# Altium project Front.PrjPCB (part 2 of 2)

## Sheet Charging.SchDoc
size A; SheetNumber: 6
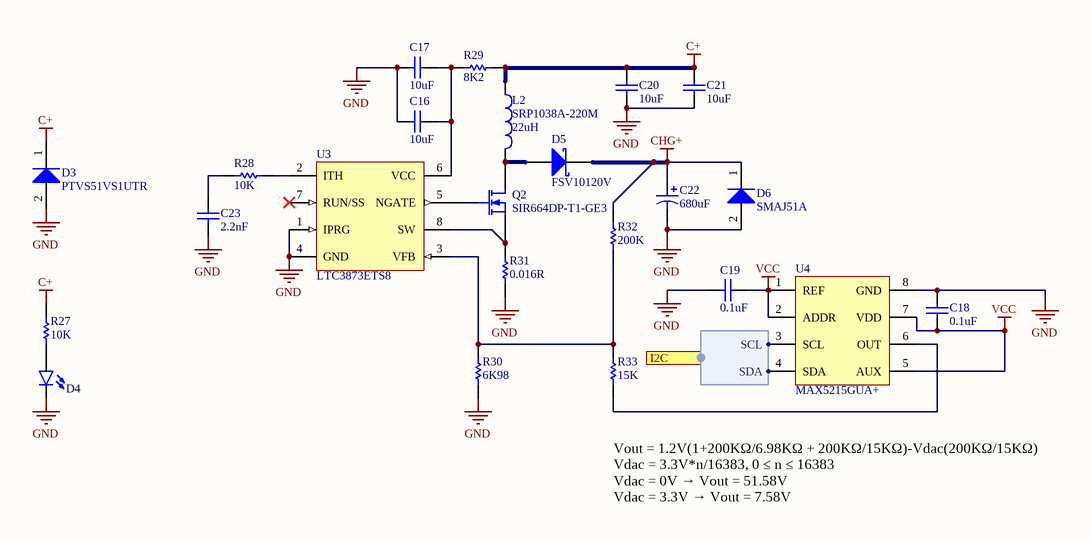
[diagram p9: Charging.SchDoc]

### Parts
C16  value 10uF  [C0603[1608X92]]  (hidden comment: 10uF 16V 0603)
C17  value 10uF  [C0603[1608X92]]  (hidden comment: 10uF 16V 0603)
C18  value 0.1uF  [C0603[1608X92]]  (hidden comment: 0.1uF 6.3V 0603)
C19  value 0.1uF  [C0603[1608X92]]  (hidden comment: 0.1uF 6.3V 0603)
C20  value 10uF  [C1206[3216X160]]  (hidden comment: 10uF 50V 1206)
C21  value 10uF  [C1206[3216X160]]  (hidden comment: 10uF 50V 1206)
C22  value 680uF  [CAP-ELECTROLYTIC[10.0x12.6]]  (hidden comment: 180uF 50V)
C23  value 2.2nF  [C0603[1608X92]]  (hidden comment: 2.2nF 50V 0603)
D3  PTVS51VS1UTR  [SOD-123W]
D4  LED_0603_GREEN_5mA  [LED0603]  (value not drawn)
D5  FSV10120V  [TO-277]
D6  SMAJ51A  [DO-214AC]
L2  SRP1038A-220M  value 22uH  [SRP1038A]
Q2  SIR664DP-T1-GE3  [PowerPak-8]
R27  value 10K  [R0603[1608]]  (hidden comment: 10K 1% 0603)
R28  value 10K  [R0603[1608]]  (hidden comment: 10K 1% 0603)
R29  value 8K2  [R0603[1608]]  (hidden comment: 8K2 1% 0603)
R30  value 6K98  [R0603[1608]]  (hidden comment: 6K98 1% 0603)
R31  value 0.016R  [R1206[3216]]  (hidden comment: 0.016R 1% 1206)
R32  value 200K  [R0603[1608]]  (hidden comment: 200K 1% 0603)
R33  value 15K  [R0603[1608]]  (hidden comment: 15K 1% 0603)
U3  LTC3873ETS8  [SOT-23-8]
U4  MAX5215GUA+  [MSOP-8]

### Ports
I2C (harness I2C)

### Harnesses
I2C: SCL, SDA

### Nets
C+: C20.2 C21.2 D3.1(K) L2.1 R27.2 R29.2
CHG+: C22.1 D5.1(K) D6.1(K) R32.2
GND: C16.1 C17.1 C18.1 C19.2 C20.1 C21.1 C22.2 C23.1 D3.2(A) D4.C D6.2(A) R30.1 R31.1 U3.1(IPRG) U3.4(GND) U4.8(GND)
VCC: C18.2 C19.1 U4.1(REF) U4.2(ADDR) U4.5(AUX) U4.7(VDD)
I2C3.SCL: U4.3(SCL) ; port I2C.SCL
I2C3.SDA: U4.4(SDA) ; port I2C.SDA
NetC16_2: C16.2 C17.2 R29.1 U3.6(VCC)
NetC23_2: C23.2 R28.1
NetD4_A: D4.A R27.1
NetD5_2: D5.2(A) L2.2 Q2.3(D)
NetQ2_1: Q2.1(S) R31.2 U3.8(SW)
NetQ2_2: Q2.2(G) U3.5(NGATE)
NetR28_2: R28.2 U3.2(ITH)
NetR30_2: R30.2 R32.1 R33.2 U3.3(VFB)
NetR33_1: R33.1 U4.6(OUT)

Not connected (* = marked no-connect by the designer): U3 7(RUN/SS)*

### Notes on the sheet
- Vout = 1.2V(1+200KΩ/6.98KΩ + 200KΩ/15KΩ)-Vdac(200KΩ/15KΩ)
  Vdac = 3.3V*n/16383, 0 ≤ n ≤ 16383
  Vdac = 0V → Vout = 51.58V
  Vdac = 3.3V → Vout = 7.58V

### Library data of the parts
C16 C17 = CAP_10uF_16V_0603_10%: 10uF 16V 10% 0603 (1608 Metric); PartNumber: GRM188R61C106KAALD; Manufacturer: Murata; TemperatureCoefficient: X5R; Mounting Technology: Surface Mount; PackageReference: 0603; PackageDescription: 0603 (1608 Metric); Voltage: 16V; Tolerance: 10%
C18 C19 = CAP_0.1uF_6.3V_0603_10%: 0.1uF 6.3V 10% 0603 (1608 Metric); PartNumber: GRM188R70J104KA01D; Manufacturer: Murata; Mounting Technology: Surface Mount; PackageReference: 0603; PackageDescription: 0603 (1608 Metric); Voltage: 6.3V; Tolerance: 10%
C20 C21 = CAP_10uF_50V_1206_20%: 10uF 50V 20% 1206 (3216 Metric); PartNumber: UMK316BBJ106ML-T; Manufacturer: Taiyo Yuden; Tolerance: 20%; Mounting Technology: Surface Mount; PackageReference: 1206; PackageDescription: 1206 (3216 Metric); Voltage: 50V
C22 = CAP_180uF_50V_20%: 180uF 50V 20%; PartNumber: PCR1H181MCL1GS; Manufacturer: Nichicon; PackageReference: 1H; PackageDescription: 5mm; Mounting Technology: Surface Mount; Voltage: 50V; Tolerance: 20%
C23 = CAP_2.2nF_50V_0603_5%: 2.2nF 50V 5% 0603 (1608 Metric); PartNumber: GRM1885C1H222JA01D; Manufacturer: Murata; TemperatureCoefficient: C0G; Mounting Technology: Surface Mount; PackageReference: 0603; PackageDescription: 0603 (1608 Metric); Voltage: 50V; Tolerance: 5%
D3 = PTVS51VS1UTR,115: Manufacturer: NXP; Mounting Technology: Surface Mount; PartNumber: PTVS51VS1UTR,115; PackageReference: SOD-123W; PackageDescription: SOD123W, 2-Leads
D4 = LED_0603_GREEN_5mA: PartNumber: LTST-C193TGKT-5A; Manufacturer: Lite-On Inc.; PackageReference: 0603; PackageDescription: 0603 (1608 Metric); Mounting Technology: Surface Mount
D5 = FSV10120V: Schottky Diodes & Rectifiers 10 Amp 120V Schottky Rectifier; Manufacturer: Fairchild Semiconductor; PackageReference: TO-277-3; PartNumber: FSV10120V; Mounting Technology: Surface Mount
D6 = SMAJ51A-E3/61: Manufacturer: Vishay; PartNumber: SMAJ51A-E3/61; PackageReference: DO-214AC; PackageDescription: DO-214AC, 2 Leads; Mounting Technology: Surface Mount
L2 = SRP1038A-220M: 22uH 20% 7A 1038; Manufacturer: Bourns; PackageReference: SRP1038A; PartNumber: SRP1038A-220M; Mounting Technology: Surface Mount; Current: 7A
Q2 = SIR664DP-T1-GE3: N-Channel MOSFET; Manufacturer: Vishay; PartNumber: SIR664DP-T1-GE3; Mounting Technology: Surface Mount; PackageReference: PowerPAK-8
R27 R28 = RES_10K_0603_1%: 10K 0.25W 1% 0603 (1005 Metric); Manufacturer: Vishay; PartNumber: RCS060310K0FKEA; Power: 0.25W; Tolerance: 1%; Mounting Technology: Surface Mount; PackageReference: 0603; PackageDescription: 0603 (1608 Metric); ComponentLink1Description: Datasheet; ComponentLink1URL: http://www.vishay.com/docs/20065/rcse3.pdf
R29 = RES_8K2_0603_1%: 8K2 0.25W 1% 0603 (1005 Metric); Manufacturer: Vishay; PartNumber: CRCW06038K20FKEAHP; Tolerance: 1%; Power: 0.25W; Mounting Technology: Surface Mount; PackageReference: 0603; PackageDescription: 0603 (1608 Metric); ComponentLink1Description: Datasheet; ComponentLink1URL: http://www.vishay.com/docs/20043/crcwhpe3.pdf
R30 = RES_6K98_0603_1%: 6K98 0.25W 1% 0603 (1005 Metric); Manufacturer: Vishay / Dale; PartNumber: CRCW06036K98FKEAHP; Tolerance: 1%; Power: 0.25W; Mounting Technology: Surface Mount; PackageReference: 0603; PackageDescription: 0603 (1608 Metric); ComponentLink1Description: Datasheet; ComponentLink1URL: http://www.vishay.com/docs/20043/crcwhpe3.pdf
R31 = RES_0.016R_1206_1%: 0.016R 1W 1% 1206 (3216 Metric); Manufacturer: Panasonic; PartNumber: ERJ-8CWFR016V; Power: 1W; Tolerance: 1%; Mounting Technology: Surface Mount; PackageReference: 1206; PackageDescription: 1206 (3216 Metric); ComponentLink1Description: Datasheet; ComponentLink1URL: https://industrial.panasonic.com/cdbs/www-data/pdf/RDA0000/AOA0000C239.pdf
R32 = RES_200K_0603_1%: 200K 0.25W 1% 0603 (1005 Metric); Manufacturer: Rohm Semiconductor; PartNumber: ESR03EZPJ204; Tolerance: 5%; Power: 0.25W; Mounting Technology: Surface Mount; PackageReference: 0603; PackageDescription: 0603 (1608 Metric); ComponentLink1Description: Datasheet; ComponentLink1URL: http://www.vishay.com/docs/20043/crcwhpe3.pdf
R33 = RES_15K_0603_1%: 15K 0.25W 1% 0603 (1005 Metric); Manufacturer: Vishay / Dale; PartNumber: CRCW060315K0FKEAHP; Tolerance: 1%; Power: 0.25W; Mounting Technology: Surface Mount; PackageReference: 0603; PackageDescription: 0603 (1608 Metric); ComponentLink1Description: Datasheet; ComponentLink1URL: http://www.vishay.com/docs/20043/crcwhpe3.pdf
U3 = LTC3873ETS8: PartNumber: LTC3873ETS8#PBF; Manufacturer: Linear Technology; PackageReference: TSOT-23-8; Mounting Technology: Surface Mount
U4 = MAX5215GUA+: 14 Bit Digital to Analog Converter; Manufacturer: Maxim Integrated; PartNumber: MAX5215GUA+; Mounting Technology: Surface Mount; PackageReference: MSOP-8

## Sheet Bluetooth.SchDoc
size A4
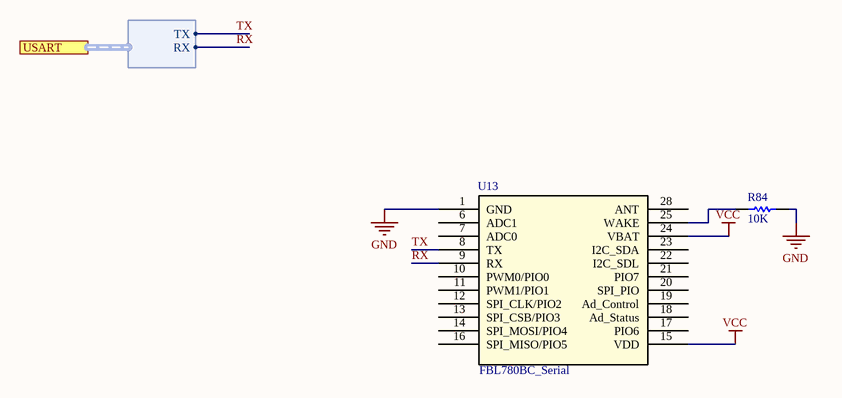
[diagram p10: Bluetooth.SchDoc]

### Parts
R84  value 10K  [R0603[1608]]  (hidden comment: 10K 1% 0603)
U13  FBL780BC_Serial  [FBL780BC_Serial]

### Ports
USART (harness USART2)

### Harnesses
USART2: TX, RX

### Nets
GND: R84.2 U13.1(GND)
VCC: U13.15(VDD) U13.24(VBAT)
RX: U13.9(RX) ; port USART.RX
TX: U13.8(TX) ; port USART.TX
NetR84_1: R84.1 U13.25(WAKE)

Not connected (* = marked no-connect by the designer): U13 6(ADC1) 7(ADC0) 10(PWM0/PIO0) 11(PWM1/PIO1) 12(SPI_CLK/PIO2) 13(SPI_CSB/PIO3) 14(SPI_MOSI/PIO4) 16(SPI_MISO/PIO5) 17(PIO6) 18(Ad_Status) 19(Ad_Control) 20(SPI_PIO) 21(PIO7) 22(I2C_SDL) 23(I2C_SDA) 28(ANT)

### Library data of the parts
R84 = RES_10K_0603_1%: as R27 on sheet Charging; Tolerance: 1%; Power: 0.25W; Mounting Technology: Surface Mount; PackageReference: 0603; PackageDescription: 0603 (1608 Metric); ComponentLink1Description: Datasheet; ComponentLink1URL: http://www.vishay.com/docs/20065/rcse3.pdf
U13 = FBL780BC_Serial: Manufacturer: Firmtech; PartNumber: FBL780BC_Serial

## Sheet CurrentSense.SchDoc
size A; SheetNumber: 8
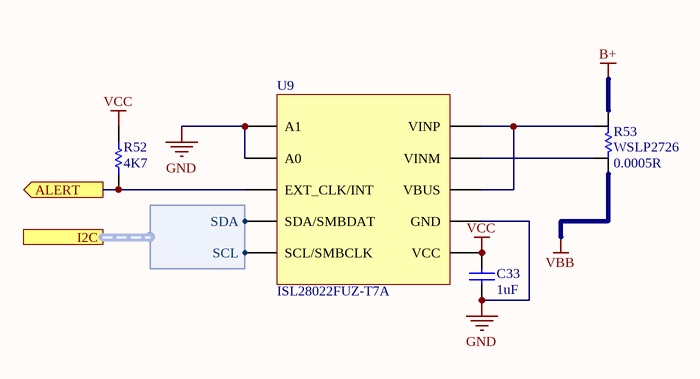
[diagram p11: CurrentSense.SchDoc]

### Parts
C33  value 1uF  [C0603[1608X92]]  (hidden comment: 1uF 6.3V 0603)
R52  value 4K7  [R0603[1608]]  (hidden comment: 4K7 1% 0603)
R53  WSLP2726  value 0.0005R  [WSL2726]
U9  ISL28022FUZ-T7A  [MSOP-10]

### Ports
ALERT (out), I2C (harness I2C)

### Harnesses
I2C: SCL, SDA

### Nets
B+: R53.2
GND: C33.1 U9.1(A1) U9.2(A0) U9.7(GND)
VBB: R53.1
VCC: C33.2 R52.2 U9.6(VCC)
I2C3.SCL: U9.5(SCL/SMBCLK) ; port I2C.SCL
I2C3.SDA: U9.4(SDA/SMBDAT) ; port I2C.SDA
NetR52_1: R52.1 U9.3(EXT_CLK/INT) ; port ALERT
NetR53_3: R53.3 U9.9(VINM)
NetR53_4: R53.4 U9.8(VBUS) U9.10(VINP)

### Library data of the parts
C33 = CAP_1uF_6.3V_0603_10%: 1uF 6.3V 10% 0603 (1608 Metric); PartNumber: GRM188R60J105KA01D; Manufacturer: Murata; TemperatureCoefficient: X5R; Mounting Technology: Surface Mount; PackageReference: 0603; PackageDescription: 0603 (1608 Metric); Voltage: 6.3V; Tolerance: 10%
R52 = RES_4K7_0603_1%: 4K7 0.25W 1% 0603 (1005 Metric); Manufacturer: Vishay / Dale; PartNumber: CRCW06034K70FKEAHP; Tolerance: 1%; Power: 0.25W; Mounting Technology: Surface Mount; PackageReference: 0603; PackageDescription: 0603 (1608 Metric); ComponentLink1Description: Datasheet; ComponentLink1URL: http://www.vishay.com/docs/20043/crcwhpe3.pdf
R53 = WSLP2726: Current Sense Resistor, 0.0005R; PartNumber: WSLP2726L5000FEA; Manufacturer: Vishay / Dale; Power: 7W; Tolerance: 1%; PackageReference: 2726; Mounting Technology: Surface Mount
U9 = ISL28022FUZ-T7A: Manufacturer: Intersil; PartNumber: ISL28022FUZ-T7A; Mounting Technology: Surface Mount; PackageReference: MSOP-10

## Sheet LTC6803.SchDoc
size A; SheetNumber: 4
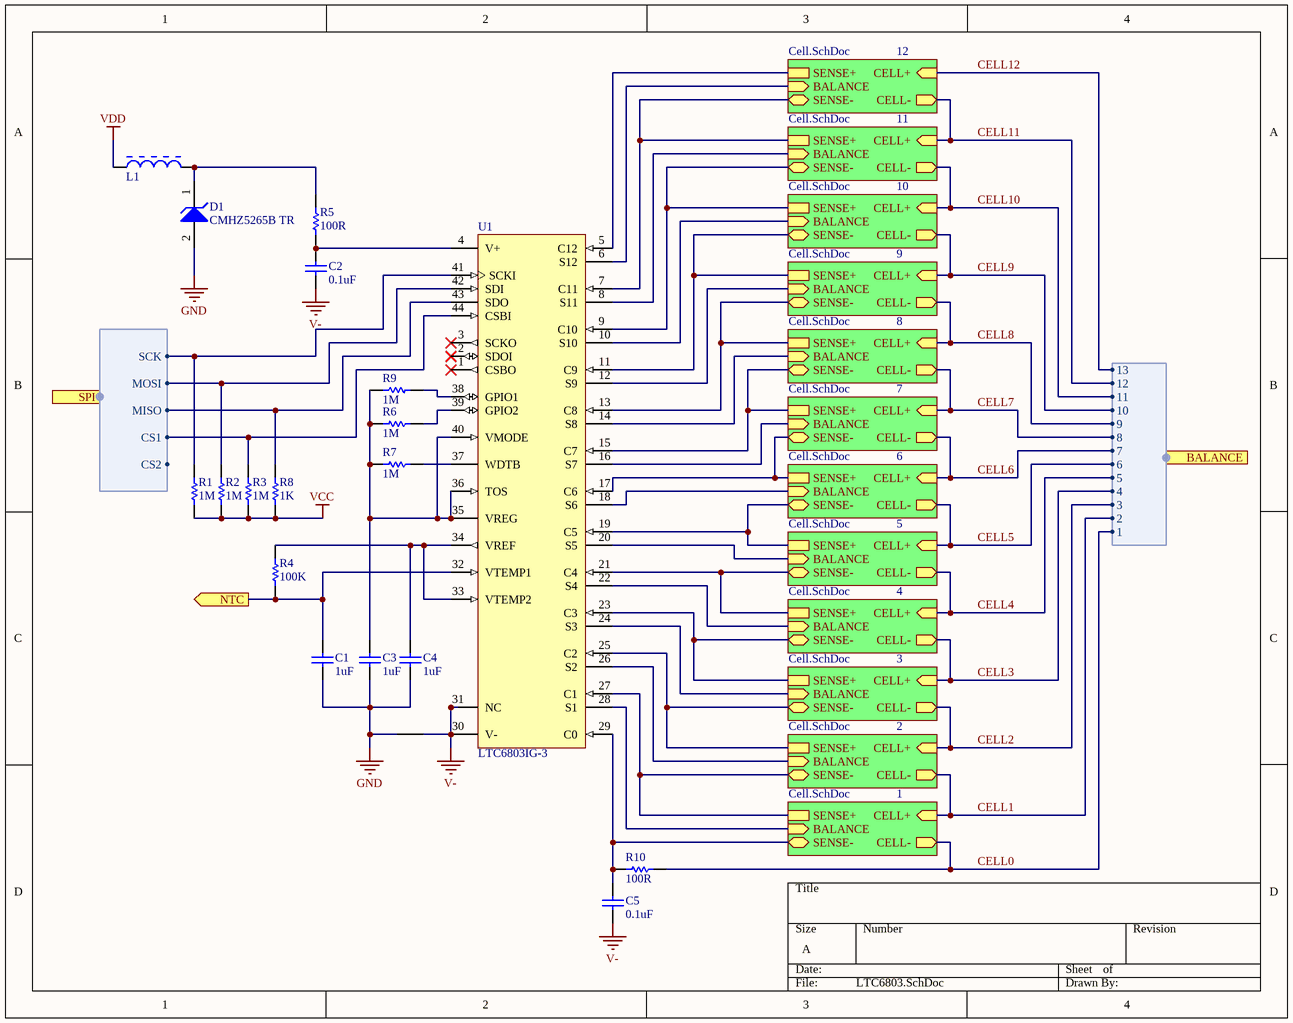
[diagram p12: LTC6803.SchDoc]

### Parts
*  NetTie  [NetTie]  (value not drawn)  (net tie, no BOM)
C1  value 1uF  [C0603[1608X92]]  (hidden comment: 1uF 6.3V 0603)
C2  value 0.1uF  [C0603[1608X92]]  (hidden comment: 0.1uF 100V 0603)
C3  value 1uF  [C0603[1608X92]]  (hidden comment: 1uF 6.3V 0603)
C4  value 1uF  [C0603[1608X92]]  (hidden comment: 1uF 6.3V 0603)
C5  value 0.1uF  [C0603[1608X92]]  (hidden comment: 0.1uF 6.3V 0603)
D1  CMHZ5265B TR  [SOD-123]
L1  MURA-FB-2  [MURA-BLM31-B60-CHIP-2_V3]  (value not drawn)
R1  value 1M  [R0603[1608]]  (hidden comment: 1M 1% 0603)
R2  value 1M  [R0603[1608]]  (hidden comment: 1M 1% 0603)
R3  value 1M  [R0603[1608]]  (hidden comment: 1M 1% 0603)
R4  value 100K  [R0603[1608]]  (hidden comment: 100K 1% 0603)
R5  value 100R  [R0603[1608]]  (hidden comment: 100R 1% 0603)
R6  value 1M  [R0603[1608]]  (hidden comment: 1M 1% 0603)
R7  value 1M  [R0603[1608]]  (hidden comment: 1M 1% 0603)
R8  value 1K  [R0603[1608]]  (hidden comment: 1K 1% 0603)
R9  value 1M  [R0603[1608]]  (hidden comment: 1M 1% 0603)
R10  value 100R  [R0603[1608]]  (hidden comment: 100R 1% 0603)
U1  LTC6803IG-3  [TSSOP-44]

### Sub-sheets
1 = Cell.SchDoc: SENSE+, SENSE- (bidir), BALANCE (in), CELL+ (in), CELL- (out)
2 = Cell.SchDoc: SENSE+, SENSE- (bidir), BALANCE (in), CELL+ (in), CELL- (out)
3 = Cell.SchDoc: SENSE+, SENSE- (bidir), BALANCE (in), CELL+ (in), CELL- (out)
4 = Cell.SchDoc: SENSE+, SENSE- (bidir), BALANCE (in), CELL+ (in), CELL- (out)
5 = Cell.SchDoc: SENSE+, SENSE- (bidir), BALANCE (in), CELL+ (in), CELL- (out)
6 = Cell.SchDoc: SENSE+, SENSE- (bidir), BALANCE (in), CELL+ (in), CELL- (out)
7 = Cell.SchDoc: SENSE+, SENSE- (bidir), BALANCE (in), CELL+ (in), CELL- (out)
8 = Cell.SchDoc: SENSE+, SENSE- (bidir), BALANCE (in), CELL+ (in), CELL- (out)
9 = Cell.SchDoc: SENSE+, SENSE- (bidir), BALANCE (in), CELL+ (in), CELL- (out)
10 = Cell.SchDoc: SENSE+, SENSE- (bidir), BALANCE (in), CELL+ (in), CELL- (out)
11 = Cell.SchDoc: SENSE+, SENSE- (bidir), BALANCE (in), CELL+ (in), CELL- (out)
12 = Cell.SchDoc: SENSE+, SENSE- (bidir), BALANCE (in), CELL+ (in), CELL- (out)

### Ports
BALANCE (harness Balance), NTC (out), SPI (harness SPI)

### Harnesses
SPI: SCK, MOSI, MISO, CS1, CS2
Balance: 13, 12, 11, 10, 9, 8, 6, 7, 5, 3, 4, 2, 1

### Nets
GND: *.1 C1.1 C3.1 C4.1 D1.2(A)
V-: *.2 C2.1 C5.1 U1.30(V-) U1.31(NC)
VCC: R1.1 R2.1 R3.1 R8.1
VDD: L1.1
CELL0: R10.1 ; sheet 1/CELL-, port BALANCE.1
CELL1: sheet 2/CELL-, sheet 1/CELL+, port BALANCE.2
CELL2: sheet 3/CELL-, sheet 2/CELL+, port BALANCE.3
CELL3: sheet 4/CELL-, sheet 3/CELL+, port BALANCE.4
CELL4: sheet 5/CELL-, sheet 4/CELL+, port BALANCE.5
CELL5: sheet 6/CELL-, sheet 5/CELL+, port BALANCE.6
CELL6: sheet 7/CELL-, sheet 6/CELL+, port BALANCE.7
CELL7: sheet 8/CELL-, sheet 7/CELL+, port BALANCE.8
CELL8: sheet 9/CELL-, sheet 8/CELL+, port BALANCE.9
CELL9: sheet 10/CELL-, sheet 9/CELL+, port BALANCE.10
CELL10: sheet 11/CELL-, sheet 10/CELL+, port BALANCE.11
CELL11: sheet 12/CELL-, sheet 11/CELL+, port BALANCE.12
CELL12: sheet 12/CELL+, port BALANCE.13
SPI2.CS1: R3.2 U1.44(CSBI) ; port SPI.CS1
SPI2.MISO: R8.2 U1.43(SDO) ; port SPI.MISO
SPI2.MOSI: R2.2 U1.42(SDI) ; port SPI.MOSI
SPI2.SCK: R1.2 U1.41(SCKI) ; port SPI.SCK
NetC1_2: C1.2 R4.1 U1.32(VTEMP1) ; port NTC
NetC2_2: C2.2 R5.1 U1.4(V+)
NetC3_2: C3.2 R6.2 R7.2 R9.2 U1.35(VREG) U1.36(TOS) U1.40(VMODE)
NetC4_2: C4.2 R4.2 U1.33(VTEMP2) U1.34(VREF)
NetC5_2: C5.2 R10.2 U1.29(C0) ; sheet 1/SENSE-
NetC23_1_2: U1.27(C1) ; sheet 2/SENSE-, sheet 1/SENSE+
NetC23_2_2: U1.25(C2) ; sheet 3/SENSE-, sheet 2/SENSE+
NetC23_3_2: U1.23(C3) ; sheet 4/SENSE-, sheet 3/SENSE+
NetC23_4_2: U1.21(C4) ; sheet 5/SENSE-, sheet 4/SENSE+
NetC23_5_2: U1.19(C5) ; sheet 6/SENSE-, sheet 5/SENSE+
NetC23_6_2: U1.17(C6) ; sheet 7/SENSE-, sheet 6/SENSE+
NetC23_7_2: U1.15(C7) ; sheet 8/SENSE-, sheet 7/SENSE+
NetC23_8_2: U1.13(C8) ; sheet 9/SENSE-, sheet 8/SENSE+
NetC23_9_2: U1.11(C9) ; sheet 10/SENSE-, sheet 9/SENSE+
NetC23_10_2: U1.9(C10) ; sheet 11/SENSE-, sheet 10/SENSE+
NetC23_11_2: U1.7(C11) ; sheet 12/SENSE-, sheet 11/SENSE+
NetC23_12_2: U1.5(C12) ; sheet 12/SENSE+
NetD1_1: D1.1(K) L1.2 R5.2
NetQ3_1_1: U1.28(S1) ; sheet 1/BALANCE
NetQ3_2_1: U1.26(S2) ; sheet 2/BALANCE
NetQ3_3_1: U1.24(S3) ; sheet 3/BALANCE
NetQ3_4_1: U1.22(S4) ; sheet 4/BALANCE
NetQ3_5_1: U1.20(S5) ; sheet 5/BALANCE
NetQ3_6_1: U1.18(S6) ; sheet 6/BALANCE
NetQ3_7_1: U1.16(S7) ; sheet 7/BALANCE
NetQ3_8_1: U1.14(S8) ; sheet 8/BALANCE
NetQ3_9_1: U1.12(S9) ; sheet 9/BALANCE
NetQ3_10_1: U1.10(S10) ; sheet 10/BALANCE
NetQ3_11_1: U1.8(S11) ; sheet 11/BALANCE
NetQ3_12_1: U1.6(S12) ; sheet 12/BALANCE
NetR6_1: R6.1 U1.39(GPIO2)
NetR7_1: R7.1 U1.37(WDTB)
NetR9_1: R9.1 U1.38(GPIO1)

Not connected (* = marked no-connect by the designer): U1 1(CSBO)* 2(SDOI)* 3(SCKO)*

### Library data of the parts
C1 C3 C4 = CAP_1uF_6.3V_0603_10%: as C33 on sheet CurrentSense; Mounting Technology: Surface Mount; PackageReference: 0603; PackageDescription: 0603 (1608 Metric); Voltage: 6.3V; Tolerance: 10%
C2 = CAP_0.1uF_100V_0603_10%: 0.1uF 100V 10% 0603 (1608 Metric); PartNumber: GRM188R72A104KA35D; Manufacturer: Murata; TemperatureCoefficient: X7R; Mounting Technology: Surface Mount; PackageReference: 0603; PackageDescription: 0603 (1608 Metric); Voltage: 100V; Tolerance: 10%
C5 = CAP_0.1uF_6.3V_0603_10%: as C18 on sheet Charging; Mounting Technology: Surface Mount; PackageReference: 0603; PackageDescription: 0603 (1608 Metric); Voltage: 6.3V; Tolerance: 10%
D1 = CMHZ5265B: Zener Diodes 500mW Zener Diode 185mA 58.9V to 2V; Manufacturer: Central Semiconductor; PartNumber: CMHZ5265B; Mounting Technology: Surface Mount; PackageReference: SOD-123; PackageDescription: SOD, 2-Leads, Body 2.69x1.6mm
L1 = MURA-FB-2: EMI Filter Beads, Chips & Arrays 1206 33 OHM; PartNumber: BLM31PG330SN1L; Manufacturer: Murata; Mounting Technology: Surface Mount; PackageReference: 1206; PackageDescription: 1206 (3216 Metric)
R1-R3 R6 R7 R9 = RES_1M_0603_1%: 1M 0.25W 1% 0603 (1005 Metric); Manufacturer: Vishay / Dale; PartNumber: CRCW06031M00JNEAHP; Tolerance: 5%; Power: 0.25W; Mounting Technology: Surface Mount; PackageReference: 0603; PackageDescription: 0603 (1608 Metric); ComponentLink1Description: Datasheet; ComponentLink1URL: http://www.vishay.com/docs/20043/crcwhpe3.pdf
R4 = RES_100K_0603_1%: 100K 0.25W 1% 0603 (1005 Metric); Manufacturer: Vishay / Dale; PartNumber: CRCW0603100KFKEAHP; Tolerance: 1%; Power: 0.25W; Mounting Technology: Surface Mount; PackageReference: 0603; PackageDescription: 0603 (1608 Metric); ComponentLink1Description: Datasheet; ComponentLink1URL: http://www.vishay.com/docs/20043/crcwhpe3.pdf
R5 R10 = RES_100R_0603_1%: 100R 0.25W 1% 0603 (1005 Metric); Manufacturer: Vishay / Dale; PartNumber: CRCW0603100RFKEAHP; Tolerance: 1%; Power: 0.25W; Mounting Technology: Surface Mount; PackageReference: 0603; PackageDescription: 0603 (1608 Metric); ComponentLink1Description: Datasheet; ComponentLink1URL: http://www.vishay.com/docs/20043/crcwhpe3.pdf
R8 = RES_1K_0603_1%: 1K 0.25W 1% 0603 (1005 Metric); Manufacturer: Vishay / Dale; PartNumber: CRCW06031K00FKEAHP; Tolerance: 1%; Power: 0.25W; Mounting Technology: Surface Mount; PackageReference: 0603; PackageDescription: 0603 (1608 Metric); ComponentLink1Description: Datasheet; ComponentLink1URL: http://www.vishay.com/docs/20043/crcwhpe3.pdf
U1 = LTC6803IG-3: PartNumber: LTC6803IG-3#PBF; Manufacturer: Linear Technology; PackageReference: TSSOP-44; Mounting Technology: Surface Mount; PackageDescription: SOP, 44-Leads, Body 13.1x5.6mm, Pitch 0.5mm

## Sheet Cell.SchDoc
size A; SheetNumber: 5
Used 12 times, as channels U_LTC6803/12, U_LTC6803/11, U_LTC6803/10, U_LTC6803/9, U_LTC6803/8, U_LTC6803/7, U_LTC6803/6, U_LTC6803/5, U_LTC6803/4, U_LTC6803/3, U_LTC6803/2, U_LTC6803/1. Parts and nets are listed once, with the designators drawn on the sheet.
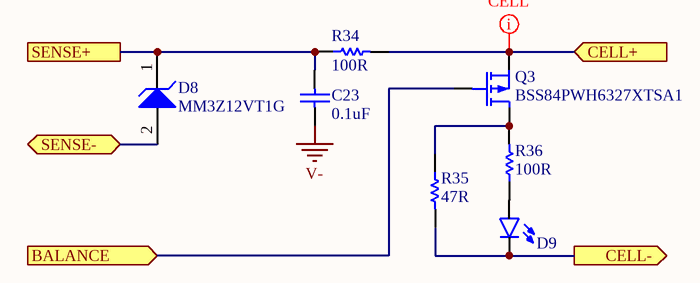
[diagram p13: Cell.SchDoc]

### Parts
C23  value 0.1uF  [C0603[1608X92]]  (hidden comment: 0.1uF 100V 0603)
D8  MM3Z12VT1G  [SOD-323]
D9  LED_0603_BLUE_5mA  [LED0603]  (value not drawn)
Q3  BSS84PWH6327XTSA1  [SOT323-3]
R34  value 100R  [R0603[1608]]  (hidden comment: 100R 1% 0603)
R35  value 47R  [R0805[2012]]  (hidden comment: 47R 5% 0805)
R36  value 100R  [R0603[1608]]  (hidden comment: 100R 1% 0603)

### Ports
BALANCE (in), CELL+ (in), CELL- (out), SENSE+, SENSE- (bidir)

### Nets
V-: C23.1
BALANCE: Q3.1(G) ; port BALANCE
CELL+: Q3.2(S) R34.1 ; port CELL+
CELL-: D9.C R35.1 ; port CELL-
SENSE+: C23.2 D8.1(K) R34.2 ; port SENSE+
SENSE-: D8.2(A) ; port SENSE-
NetD9_A: D9.A R36.2
NetQ3_3: Q3.3(D) R35.2 R36.1

### Channels
U_LTC6803/12: designators end in _12; ports BALANCE=NetQ3_12_1 CELL+=CELL12 CELL-=CELL11 SENSE+=NetC23_12_2 SENSE-=NetC23_11_2
U_LTC6803/11: designators end in _11; ports BALANCE=NetQ3_11_1 CELL+=CELL11 CELL-=CELL10 SENSE+=NetC23_11_2 SENSE-=NetC23_10_2
U_LTC6803/10: designators end in _10; ports BALANCE=NetQ3_10_1 CELL+=CELL10 CELL-=CELL9 SENSE+=NetC23_10_2 SENSE-=NetC23_9_2
U_LTC6803/9: designators end in _9; ports BALANCE=NetQ3_9_1 CELL+=CELL9 CELL-=CELL8 SENSE+=NetC23_9_2 SENSE-=NetC23_8_2
U_LTC6803/8: designators end in _8; ports BALANCE=NetQ3_8_1 CELL+=CELL8 CELL-=CELL7 SENSE+=NetC23_8_2 SENSE-=NetC23_7_2
U_LTC6803/7: designators end in _7; ports BALANCE=NetQ3_7_1 CELL+=CELL7 CELL-=CELL6 SENSE+=NetC23_7_2 SENSE-=NetC23_6_2
U_LTC6803/6: designators end in _6; ports BALANCE=NetQ3_6_1 CELL+=CELL6 CELL-=CELL5 SENSE+=NetC23_6_2 SENSE-=NetC23_5_2
U_LTC6803/5: designators end in _5; ports BALANCE=NetQ3_5_1 CELL+=CELL5 CELL-=CELL4 SENSE+=NetC23_5_2 SENSE-=NetC23_4_2
U_LTC6803/4: designators end in _4; ports BALANCE=NetQ3_4_1 CELL+=CELL4 CELL-=CELL3 SENSE+=NetC23_4_2 SENSE-=NetC23_3_2
U_LTC6803/3: designators end in _3; ports BALANCE=NetQ3_3_1 CELL+=CELL3 CELL-=CELL2 SENSE+=NetC23_3_2 SENSE-=NetC23_2_2
U_LTC6803/2: designators end in _2; ports BALANCE=NetQ3_2_1 CELL+=CELL2 CELL-=CELL1 SENSE+=NetC23_2_2 SENSE-=NetC23_1_2
U_LTC6803/1: designators end in _1; ports BALANCE=NetQ3_1_1 CELL+=CELL1 CELL-=CELL0 SENSE+=NetC23_1_2 SENSE-=NetC5_2

### Layout directives
net class CELL: CELL12

### Library data of the parts
C23 = CAP_0.1uF_100V_0603_10%: as C2 on sheet LTC6803; Mounting Technology: Surface Mount; PackageReference: 0603; PackageDescription: 0603 (1608 Metric); Voltage: 100V; Tolerance: 10%
D8 = MM3Z12VT1G: Zener Voltage Regulator, 300 mW, 2-Pin SOD-323, Tape and Reel; Manufacturer: ON Semiconductor; Mounting Technology: Surface Mount; PackageDescription: SOD, 2-Leads; PartNumber: MM3Z12VT1G; PackageReference: SOD-323
D9 = LED_0603_BLUE_5mA: PartNumber: LTST-C193TBKT-5A; Manufacturer: Lite-On Inc.; PackageReference: 0603; PackageDescription: 0603 (1608 Metric); Mounting Technology: Surface Mount
Q3 = BSS84PW H6327: P-Channel MOSFET; Manufacturer: Infineon; Mounting Technology: Surface Mount; PartNumber: BSS84PWH6327XTSA1; PackageReference: SOT323-3
R34 R36 = RES_100R_0603_1%: as R5 on sheet LTC6803; Tolerance: 1%; Power: 0.25W; Mounting Technology: Surface Mount; PackageReference: 0603; PackageDescription: 0603 (1608 Metric); ComponentLink1Description: Datasheet; ComponentLink1URL: http://www.vishay.com/docs/20043/crcwhpe3.pdf
R35 = RES_47R_0805_5%: 47R 0.5W 5% 0805 (2012 Metric); Manufacturer: Panasonic; PartNumber: ERJ-P06J470V; Tolerance: 5%; Power: 0.5W; Mounting Technology: Surface Mount; PackageReference: 0805; PackageDescription: 0805 (2012 Metric); ComponentLink1Description: Datasheet; ComponentLink1URL: https://industrial.panasonic.com/cdbs/www-data/pdf/RDA0000/AOA0000C243.pdf

## Sheet Flash.SchDoc
size A; SheetNumber: 12
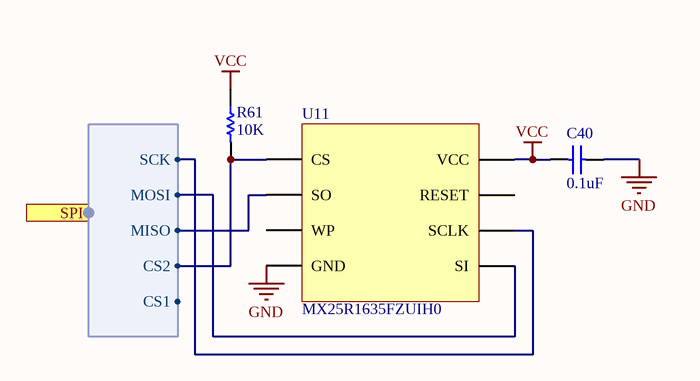
[diagram p14: Flash.SchDoc]

### Parts
C40  value 0.1uF  [C0603[1608X92]]  (hidden comment: 0.1uF 6.3V 0603)
R61  value 10K  [R0603[1608]]  (hidden comment: 10K 1% 0603)
U11  MX25R1635FZUIH0  [USON-8]

### Ports
SPI (harness SPI)

### Harnesses
SPI: SCK, MOSI, MISO, CS2, CS1

### Nets
GND: C40.2 U11.4(GND)
VCC: C40.1 R61.2 U11.8(VCC)
SPI2.CS2: R61.1 U11.1(CS) ; port SPI.CS2
SPI2.MISO: U11.2(SO) ; port SPI.MISO
SPI2.MOSI: U11.5(SI) ; port SPI.MOSI
SPI2.SCK: U11.6(SCLK) ; port SPI.SCK

Not connected (* = marked no-connect by the designer): U11 3(WP) 7(RESET)

### Library data of the parts
C40 = CAP_0.1uF_6.3V_0603_10%: as C18 on sheet Charging; Mounting Technology: Surface Mount; PackageReference: 0603; PackageDescription: 0603 (1608 Metric); Voltage: 6.3V; Tolerance: 10%
R61 = RES_10K_0603_1%: as R27 on sheet Charging; Tolerance: 1%; Power: 0.25W; Mounting Technology: Surface Mount; PackageReference: 0603; PackageDescription: 0603 (1608 Metric); ComponentLink1Description: Datasheet; ComponentLink1URL: http://www.vishay.com/docs/20065/rcse3.pdf
U11 = MX25R1635FZUIH0: pin to pad: 4>4+9; Manufacturer: Macronix; PartNumber: MX25R1635FZUIH0; Mounting Technology: Surface Mount; PackageReference: USON-8

## Nets that join several sheets
5V: 3V3 (10 pins), Connectors (5 pins), A_L (R66_A_L.2 R67_A_L.2), A_R (R66_A_R.2 R67_A_R.2)
AVDD: 3V3 (R81.2 R82.1), A_L (C68_A_L.2 U12_A_L.9), A_R (C68_A_R.2 U12_A_R.9)
B+: Switches (D16.1), CurrentSense (R53.2)
C1: Switches (D18.1 Q9.2 R41.2), Connectors (*1.2), RTCC (C34.2 U10.3)
C+: Switches (R38.2), Charging (6 pins)
CHG+: Switches (5 pins), Connectors (JP4.1), Charging (C22.1 D5.1 D6.1 R32.2)
GND: 3V3 (20 pins), MCU (30 pins), Switches (23 pins), Connectors (16 pins), CAN (C32.2 U8.2), RTCC (C34.1 C35.2 U10.4), Buzzer (Q13.2 R59.1), A_L (12 pins), Charging (16 pins), Bluetooth (R84.2 U13.1), A_R (12 pins), CurrentSense (C33.1 U9.1 U9.2 U9.7), LTC6803 (5 pins), Flash (C40.2 U11.4)
REF: 3V3 (R82.2 R83.1), A_L (C70_A_L.2 C71_A_L.2 U12_A_L.14), A_R (C70_A_R.2 C71_A_R.2 U12_A_R.14)
V-: LTC6803 (5 pins), U_LTC6803/12 (C23_12.1), U_LTC6803/11 (C23_11.1), U_LTC6803/10 (C23_10.1), U_LTC6803/9 (C23_9.1), U_LTC6803/8 (C23_8.1), U_LTC6803/7 (C23_7.1), U_LTC6803/6 (C23_6.1), U_LTC6803/5 (C23_5.1), U_LTC6803/4 (C23_4.1), U_LTC6803/3 (C23_3.1), U_LTC6803/2 (C23_2.1), U_LTC6803/1 (C23_1.1)
VBB: Switches (8 pins), CurrentSense (R53.1)
VCC: 3V3 (5 pins), MCU (36 pins), Switches (U7.5 U7.7), Connectors (6 pins), CAN (C32.1 U8.3), RTCC (C35.1 U10.8), Buzzer (LS1.1), A_L (C48_A_L.2 C49_A_L.2 U12_A_L.22), Charging (6 pins), Bluetooth (U13.15 U13.24), A_R (C48_A_R.2 C49_A_R.2 U12_A_R.22), CurrentSense (C33.2 R52.2 U9.6), LTC6803 (R1.1 R2.1 R3.1 R8.1), Flash (C40.1 R61.2 U11.8)
VDD: 3V3 (6 pins), Switches (Q7.2 R57.2), LTC6803 (L1.1)
VUSB: 3V3 (D11.2 D15.1), MCU (U2.69), Connectors (JP6.1)
AINP: Connectors (JP7.1), A_R (C55_A_R.2 R69_A_R.1 U12_A_R.12)
AINP: Connectors (JP7.4), A_L (C55_A_L.2 R69_A_L.1 U12_A_L.12)
CELL0: Connectors (JP1.1), LTC6803 (R10.1), U_LTC6803/1 (D9_1.C R35_1.1)
CELL1: Connectors (*1.1 JP1.2), U_LTC6803/2 (D9_2.C R35_2.1), U_LTC6803/1 (Q3_1.2 R34_1.1)
CELL2: Connectors (JP1.3), U_LTC6803/3 (D9_3.C R35_3.1), U_LTC6803/2 (Q3_2.2 R34_2.1)
CELL3: Connectors (JP1.4), U_LTC6803/4 (D9_4.C R35_4.1), U_LTC6803/3 (Q3_3.2 R34_3.1)
CELL4: Connectors (JP1.5), U_LTC6803/5 (D9_5.C R35_5.1), U_LTC6803/4 (Q3_4.2 R34_4.1)
CELL5: Connectors (JP1.6), U_LTC6803/6 (D9_6.C R35_6.1), U_LTC6803/5 (Q3_5.2 R34_5.1)
CELL6: Connectors (JP1.7), U_LTC6803/7 (D9_7.C R35_7.1), U_LTC6803/6 (Q3_6.2 R34_6.1)
CELL7: Connectors (JP1.8), U_LTC6803/8 (D9_8.C R35_8.1), U_LTC6803/7 (Q3_7.2 R34_7.1)
CELL8: Connectors (JP1.9), U_LTC6803/9 (D9_9.C R35_9.1), U_LTC6803/8 (Q3_8.2 R34_8.1)
CELL9: Connectors (JP1.10), U_LTC6803/10 (D9_10.C R35_10.1), U_LTC6803/9 (Q3_9.2 R34_9.1)
CELL10: Connectors (JP1.11), U_LTC6803/11 (D9_11.C R35_11.1), U_LTC6803/10 (Q3_10.2 R34_10.1)
CELL11: Connectors (JP1.12), U_LTC6803/12 (D9_12.C R35_12.1), U_LTC6803/11 (Q3_11.2 R34_11.1)
CELL12: Connectors (JP1.13), U_LTC6803/12 (Q3_12.2 R34_12.1)
I2C3.SCL: RTCC (U10.6), Charging (U4.3), CurrentSense (U9.5)
I2C3.SDA: RTCC (U10.5), Charging (U4.4), CurrentSense (U9.4)
NetC1_2: Connectors (JP2.1), LTC6803 (C1.2 R4.1 U1.32)
NetC5_2: LTC6803 (C5.2 R10.2 U1.29), U_LTC6803/1 (D8_1.2)
NetC23_1_2: LTC6803 (U1.27), U_LTC6803/2 (D8_2.2), U_LTC6803/1 (C23_1.2 D8_1.1 R34_1.2)
NetC23_2_2: LTC6803 (U1.25), U_LTC6803/3 (D8_3.2), U_LTC6803/2 (C23_2.2 D8_2.1 R34_2.2)
NetC23_3_2: LTC6803 (U1.23), U_LTC6803/4 (D8_4.2), U_LTC6803/3 (C23_3.2 D8_3.1 R34_3.2)
NetC23_4_2: LTC6803 (U1.21), U_LTC6803/5 (D8_5.2), U_LTC6803/4 (C23_4.2 D8_4.1 R34_4.2)
NetC23_5_2: LTC6803 (U1.19), U_LTC6803/6 (D8_6.2), U_LTC6803/5 (C23_5.2 D8_5.1 R34_5.2)
NetC23_6_2: LTC6803 (U1.17), U_LTC6803/7 (D8_7.2), U_LTC6803/6 (C23_6.2 D8_6.1 R34_6.2)
NetC23_7_2: LTC6803 (U1.15), U_LTC6803/8 (D8_8.2), U_LTC6803/7 (C23_7.2 D8_7.1 R34_7.2)
NetC23_8_2: LTC6803 (U1.13), U_LTC6803/9 (D8_9.2), U_LTC6803/8 (C23_8.2 D8_8.1 R34_8.2)
NetC23_9_2: LTC6803 (U1.11), U_LTC6803/10 (D8_10.2), U_LTC6803/9 (C23_9.2 D8_9.1 R34_9.2)
NetC23_10_2: LTC6803 (U1.9), U_LTC6803/11 (D8_11.2), U_LTC6803/10 (C23_10.2 D8_10.1 R34_10.2)
NetC23_11_2: LTC6803 (U1.7), U_LTC6803/12 (D8_12.2), U_LTC6803/11 (C23_11.2 D8_11.1 R34_11.2)
NetC23_12_2: LTC6803 (U1.5), U_LTC6803/12 (C23_12.2 D8_12.1 R34_12.2)
NetJP3_1: Connectors (JP3.1), CAN (R58.2 U8.7)
NetJP3_2: Connectors (JP3.2), CAN (R58.1 U8.6)
NetJP4_2: Switches (R46.2), Connectors (JP4.2)
NetJP8_2: MCU (U2.34), Connectors (JP8.2)
NetJP9_2: MCU (U2.91), Connectors (JP9.2)
NetJP10_1: MCU (U2.61), Connectors (JP10.1)
NetJP11_1: MCU (U2.62), Connectors (JP11.1)
NetJP15_1: MCU (U2.22), Connectors (JP15.1)
NetJP15_2: MCU (U2.23), Connectors (JP15.2)
NetQ1_1: MCU (Q1.1), Switches (Q12.1 R46.1 R47.2)
NetQ3_1_1: LTC6803 (U1.28), U_LTC6803/1 (Q3_1.1)
NetQ3_2_1: LTC6803 (U1.26), U_LTC6803/2 (Q3_2.1)
NetQ3_3_1: LTC6803 (U1.24), U_LTC6803/3 (Q3_3.1)
NetQ3_4_1: LTC6803 (U1.22), U_LTC6803/4 (Q3_4.1)
NetQ3_5_1: LTC6803 (U1.20), U_LTC6803/5 (Q3_5.1)
NetQ3_6_1: LTC6803 (U1.18), U_LTC6803/6 (Q3_6.1)
NetQ3_7_1: LTC6803 (U1.16), U_LTC6803/7 (Q3_7.1)
NetQ3_8_1: LTC6803 (U1.14), U_LTC6803/8 (Q3_8.1)
NetQ3_9_1: LTC6803 (U1.12), U_LTC6803/9 (Q3_9.1)
NetQ3_10_1: LTC6803 (U1.10), U_LTC6803/10 (Q3_10.1)
NetQ3_11_1: LTC6803 (U1.8), U_LTC6803/11 (Q3_11.1)
NetQ3_12_1: LTC6803 (U1.6), U_LTC6803/12 (Q3_12.1)
NetQ9_1: MCU (U2.2), Switches (Q9.1 R41.1), RTCC (U10.7)
NetQ11_1: MCU (U2.3), Switches (Q11.1 R45.2)
NetQ13_1: MCU (U2.5), Buzzer (Q13.1 R59.2)
NetR22_2: MCU (R22.2), Switches (U7.10)
NetR39_1: MCU (U2.15), Switches (R39.1 R40.2)
NetR52_1: MCU (U2.77), CurrentSense (R52.1 U9.3)
NetU2_85: MCU (U2.85), Switches (U7.8)
NetU2_86: MCU (U2.86), Switches (U7.6)
NetU2_87: MCU (U2.87), Switches (U7.4)
SPI1.MISO: A_L (U12_A_L.2), A_R (U12_A_R.2)
SPI1.MOSI: A_L (U12_A_L.1), A_R (U12_A_R.1)
SPI1.RSTB: A_L (U12_A_L.5), A_R (U12_A_R.5)
SPI1.SCK: A_L (U12_A_L.24), A_R (U12_A_R.24)
SPI1.SYNC: A_L (U12_A_L.4), A_R (U12_A_R.4)
SPI2.MISO: LTC6803 (R8.2 U1.43), Flash (U11.2)
SPI2.MOSI: LTC6803 (R2.2 U1.42), Flash (U11.5)
SPI2.SCK: LTC6803 (R1.2 U1.41), Flash (U11.6)